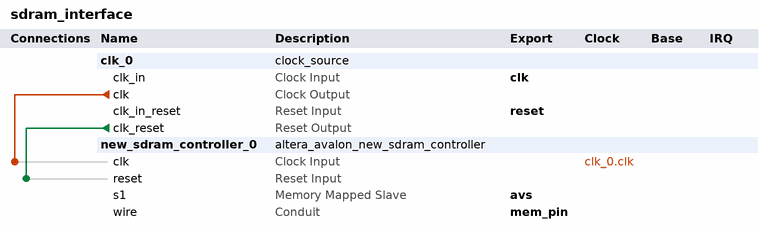
[diagram p0: system contents]
# Platform Designer (Qsys) system sdram_interface, Cyclone IV E EP4CE6F17C8
# Parameters at their usual value, and those the tool derives, are not listed.
package require -exact qsys 20.1
create_system sdram_interface
set_project_property DEVICE_FAMILY {Cyclone IV E}
set_project_property DEVICE EP4CE6F17C8

add_instance clk_0 clock_source 20.1
set_instance_parameter_value clk_0 clockFrequency 50000000

add_instance new_sdram_controller_0 altera_avalon_new_sdram_controller 20.1
set_instance_parameter_value new_sdram_controller_0 TAC 5.5
set_instance_parameter_value new_sdram_controller_0 TRCD 30.0
set_instance_parameter_value new_sdram_controller_0 TRP 30.0
set_instance_parameter_value new_sdram_controller_0 casLatency 3
set_instance_parameter_value new_sdram_controller_0 columnWidth 9
set_instance_parameter_value new_sdram_controller_0 dataWidth 16
set_instance_parameter_value new_sdram_controller_0 generateSimulationModel false
set_instance_parameter_value new_sdram_controller_0 initRefreshCommands 8
set_instance_parameter_value new_sdram_controller_0 model single_Micron_MT48LC4M32B2_7_chip
set_instance_parameter_value new_sdram_controller_0 numberOfBanks 4
set_instance_parameter_value new_sdram_controller_0 numberOfChipSelects 1
set_instance_parameter_value new_sdram_controller_0 powerUpDelay 200.0
set_instance_parameter_value new_sdram_controller_0 refreshPeriod 7.8
set_instance_parameter_value new_sdram_controller_0 rowWidth 13

# connections
add_connection clk_0.clk new_sdram_controller_0.clk clock
add_connection clk_0.clk_reset new_sdram_controller_0.reset reset

# exported interfaces
add_interface avs avalon slave
set_interface_property avs EXPORT_OF new_sdram_controller_0.s1
add_interface clk clock sink
set_interface_property clk EXPORT_OF clk_0.clk_in
add_interface mem_pin conduit end
set_interface_property mem_pin EXPORT_OF new_sdram_controller_0.wire
add_interface reset reset sink
set_interface_property reset EXPORT_OF clk_0.clk_in_reset

set_interconnect_requirement {$system} qsys_mm.clockCrossingAdapter HANDSHAKE
set_interconnect_requirement {$system} qsys_mm.enableEccProtection FALSE
set_interconnect_requirement {$system} qsys_mm.insertDefaultSlave FALSE
set_interconnect_requirement {$system} qsys_mm.maxAdditionalLatency 1

save_system sdram_interface.qsys
